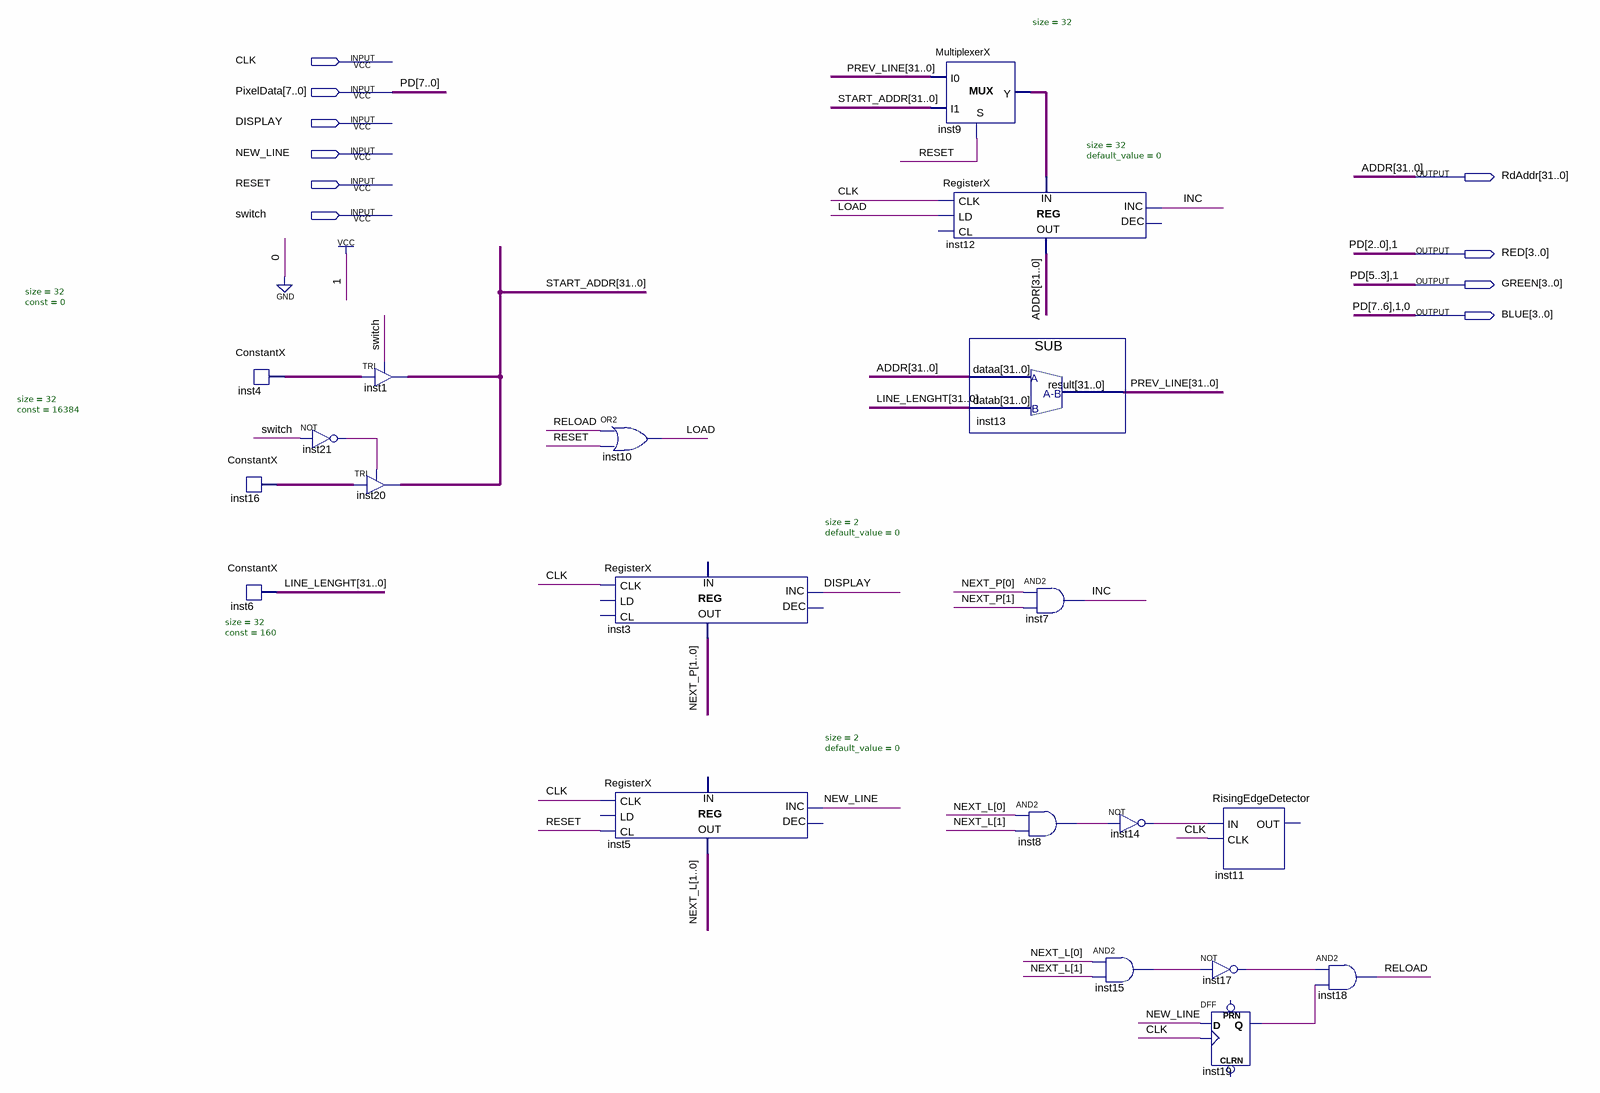
[diagram p0: schematic sheet]
// Quartus schematic DrawPixel.bdf as structural Verilog: 20 symbols, 10 pins
module DrawPixel (
  input  CLK,
  input  [7:0] PixelData,
  input  DISPLAY,
  input  NEW_LINE,
  input  RESET,
  input  switch,
  output [31:0] RdAddr,
  output [3:0] RED,
  output [3:0] GREEN,
  output [3:0] BLUE
);

  wire INC, inst8_out, inst14_out, inst15_out, inst17_out, inst19_q, inst21_out, LOAD, RELOAD;
  wire [1:0] NEXT_L, NEXT_P;
  wire [31:0] inst4_data_out, inst9_y, inst16_data_out, LINE_LENGHT, PREV_LINE, START_ADDR;

  ConstantX #(.size(32), .\const (0)) inst4 (.DATA_OUT(inst4_data_out));
  ConstantX #(.size(32), .\const (16384)) inst16 (.DATA_OUT(inst16_data_out));
  ConstantX #(.size(32), .\const (160)) inst6 (.DATA_OUT(LINE_LENGHT));
  not inst21 (inst21_out, switch);
  TRI inst1[31:0] (.IN(inst4_data_out), .OE(switch), .OUT(START_ADDR));
  TRI inst20[31:0] (.IN(inst16_data_out), .OE(inst21_out), .OUT(START_ADDR));
  or inst10 (LOAD, RELOAD, RESET);
  RegisterX #(.size(2), .default_value(0)) inst3 (
    .CLK(CLK), .INC(DISPLAY), .DATA_OUT(NEXT_P));  // open: LD, CL, DEC, DATA_IN
  RegisterX #(.size(2), .default_value(0)) inst5 (
    .CLK(CLK), .CL(RESET), .INC(NEW_LINE), .DATA_OUT(NEXT_L));  // open: LD, DEC, DATA_IN
  MultiplexerX #(.size(32)) inst9 (.S(RESET), .I0(PREV_LINE), .I1(START_ADDR), .Y(inst9_y));
  RegisterX #(.size(32), .default_value(0)) inst12 (
    .CLK(CLK), .LD(LOAD), .INC(INC), .DATA_IN(inst9_y), .DATA_OUT(RdAddr));  // open: CL, DEC
  SUB inst13 (.dataa(RdAddr), .datab(LINE_LENGHT), .result(PREV_LINE));
  and inst7 (INC, NEXT_P[0], NEXT_P[1]);
  and inst8 (inst8_out, NEXT_L[0], NEXT_L[1]);
  not inst14 (inst14_out, inst8_out);
  and inst15 (inst15_out, NEXT_L[0], NEXT_L[1]);
  RisingEdgeDetector inst11 (.IN(inst14_out), .CLK(CLK));  // open: OUT
  not inst17 (inst17_out, inst15_out);
  DFF inst19 (.CLK(CLK), .D(NEW_LINE), .Q(inst19_q));  // open: CLRN, PRN
  and inst18 (RELOAD, inst17_out, inst19_q);

  assign BLUE = {PixelData[7:6], 2'b10};
  assign GREEN = {PixelData[5:3], 1'b1};
  assign RED = {PixelData[2:0], 1'b1};

  // Other names for the same wires on the sheet: ADDR[31:0] = RdAddr; PD[7:0] = PixelData
endmodule
